# EAGLE schematic TRACKER SOM EVAL BOARD v1.0 (EAGLE 9.6.2)

## Sheet 1 of 5
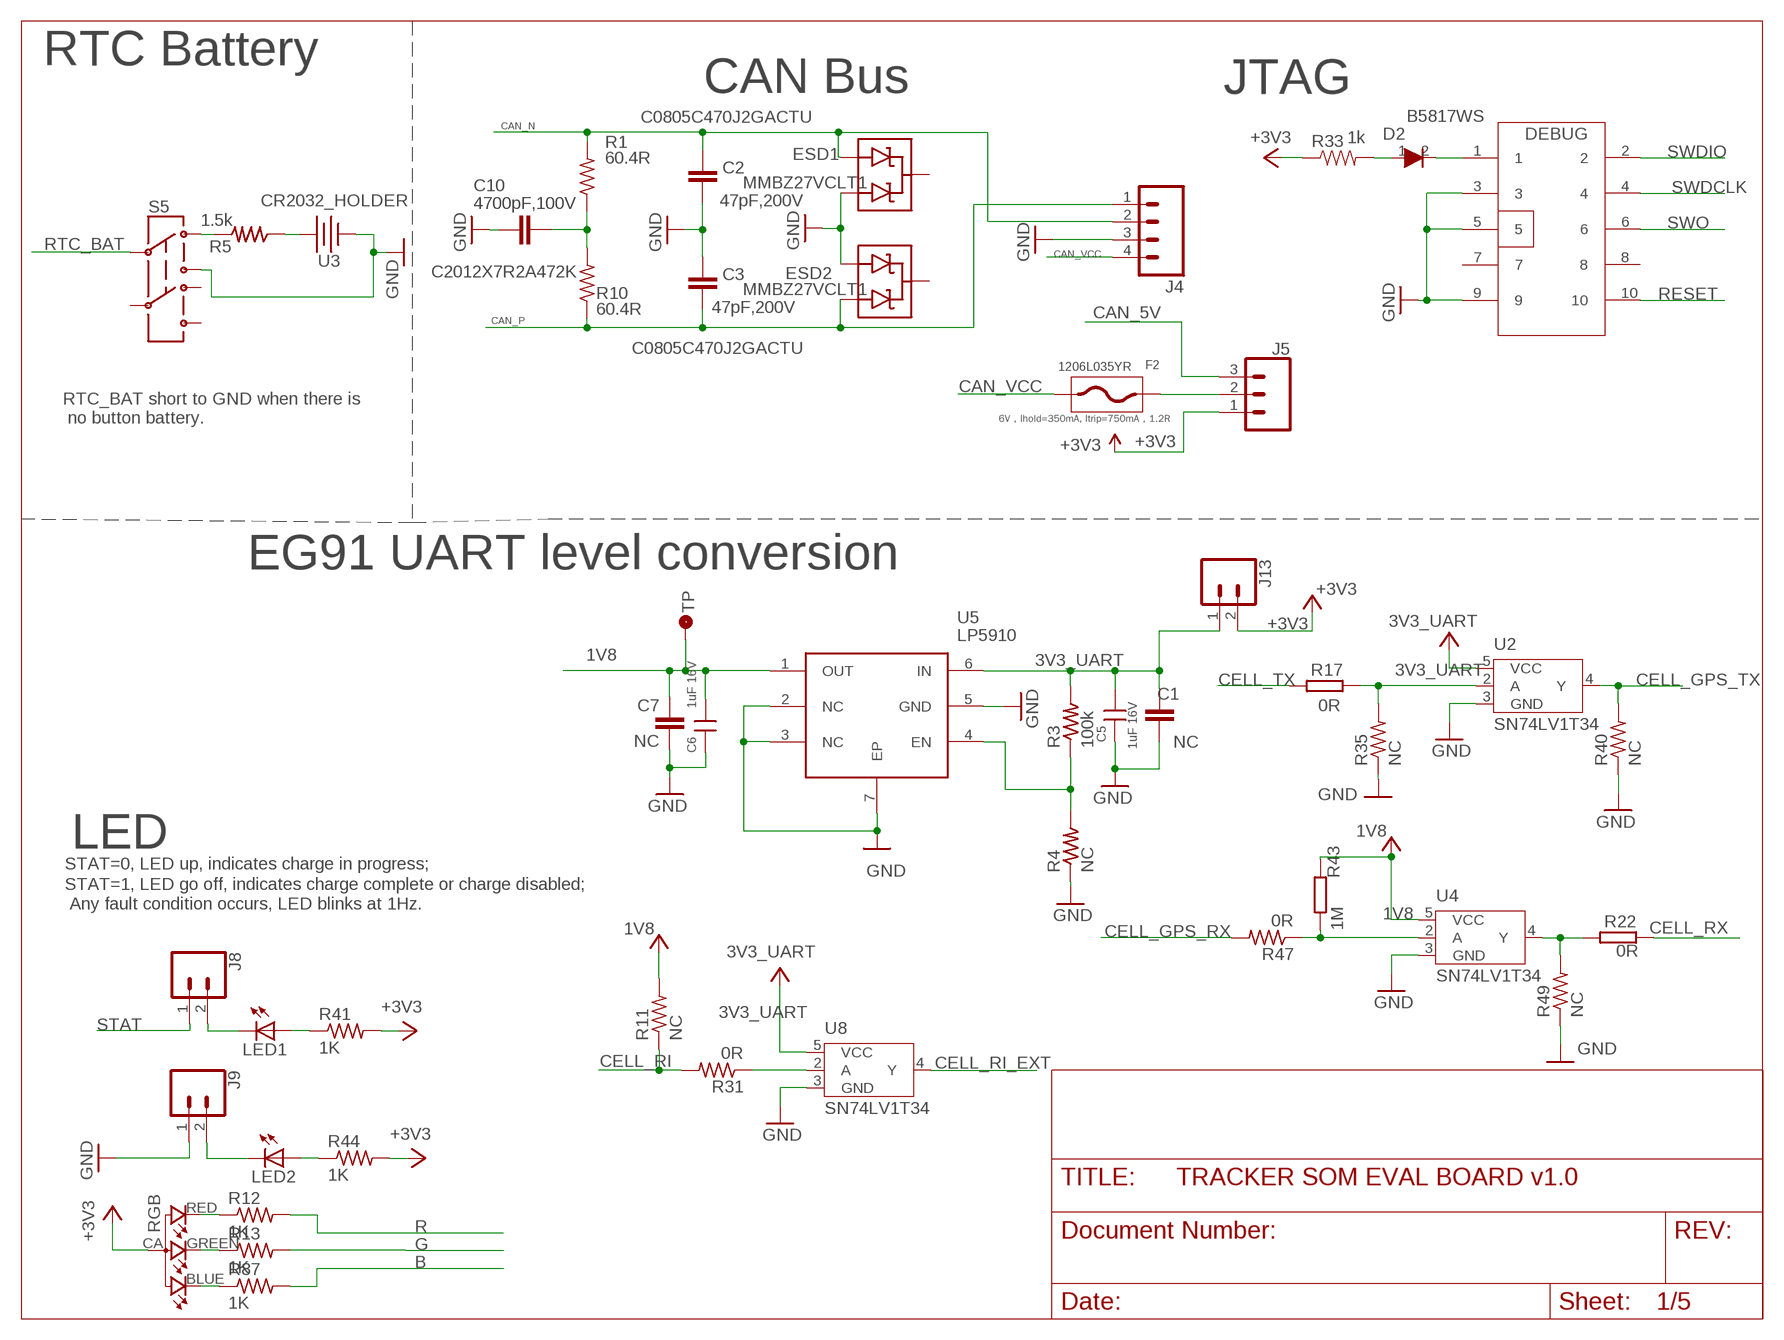
[diagram p0: schematic, sheet 1]

### Parts
C1  NC  C-EUC0805  [C0805]
C2  47pF,200V  C-EUC0805  [C0805]
C3  47pF,200V  C-EUC0805  [C0805]
C5  1uF 16V  CAPC0603  [C0603]
C6  1uF 16V  CAPC0603  [C0603]
C7  NC  C-EUC0805  [C0805]
C10  4700pF,100V  C-EUC0805  [C0805]
D2  B5817WS  DIODESOD323  [SOD-323]
DEBUG  CON 2X5P  CON5X2  [CON5X2_1.27]
ESD1  MMBZ27VCLT1  [SOT23-3]
ESD2  MMBZ27VCLT1  [SOT23-3]
F2  1206L035YR  FUSEF1206  [R1206]
J4  M04SCREW  [SCREWTERMINAL-3.5MM-4]
J5  CONN_03_2.54MM  [1X03]
J8  CONN_02  [1X02]
J9  CONN_02  [1X02]
J13  CONN_02  [1X02]
LED1  LED0603  [LED-0603]
LED2  LED0603  [LED-0603]
R1  60.4R  R-US_R1206  [R1206]
R3  100k  RES0402S  [R-0402S]
R4  NC  RES0402S  [R-0402S]
R5  1.5k  RES0402S  [R-0402S]
R10  60.4R  R-US_R1206  [R1206]
R11  NC  R-US_  [R0402_B]
R12  1K  R-US_R0603  [R0603]
R13  1K  R-US_R0603  [R0603]
R17  0R  RESR0603  [R0603]
R22  0R  RESR0603  [R0603]
R31  0R  R-US_  [R0402_B]
R33  1k  RESISTOR0603  [0603]
R35  NC  R-US_  [R0402_B]
R40  NC  R-US_  [R0402_B]
R41  1K  R-US_R0603  [R0603]
R43  1M  REDBEAR_RESR0603  [REDBEAR_R0603]
R44  1K  R-US_R0603  [R0603]
R47  0R  R-US_  [R0402_B]
R49  NC  R-US_  [R0402_B]
R87  1K  R-US_R0603  [R0603]
RGB  RGB-LED-CLMVB-FKARGB  [PLCC4-2MM-RGB]
S5  SWITCH-DPDT  [SWITCH-2.5X3.2-6]
U2  SN74LV1T34  [SC70-5]
U3  CR2032_HOLDER  [CR2032_HOLDER]
U4  SN74LV1T34  [SC70-5]
U5  LP5910  [QFN6P]
U8  SN74LV1T34  [SC70-5]
U$4  TP5  [TP30_TOP]

### Nets
1V8: C6.1 C7.1 R11.2 R43.1 U4.5(VCC) U5.1(OUT) U$4.P$1(TP)
3V3_UART: C1.1 C5.1 J13.1 R3.2 U2.5(VCC) U5.6(IN) U8.5(VCC)
+3V3 [+3V3]: J5.1 J13.2 R33.1 R41.2 R44.2 RGB.CA ; also sheet 2,4,5
B: R87.2 ; also sheet 2,5
CAN_5V: J5.3 ; also sheet 2
CAN_N [CAN]: C2.1 ESD1.2(A2) J4.2 R1.2 ; also sheet 2
CAN_P [CAN]: C3.2 ESD2.1(A1) J4.1 R10.1 ; also sheet 2
CAN_VCC: F2.1 J4.4
CELL_GPS_RX: R47.2 ; also sheet 5
CELL_GPS_TX: R40.2 U2.4(Y) ; also sheet 5
CELL_RI: R11.1 R31.2 ; also sheet 2
CELL_RI_EXT: U8.4(Y) ; also sheet 5
CELL_RX: R22.1 ; also sheet 2
CELL_TX: R17.2 ; also sheet 2
G: R13.2 ; also sheet 2,5
GND: C1.2 C2.2 C3.1 C5.2 C6.2 C7.2 C10.1 DEBUG.3 DEBUG.5 DEBUG.9 ESD1.1(A1) ESD2.2(A2) J4.3 J9.1 R4.1 R35.1 R40.1 R49.1 S5.3 U2.3(GND) U3.- U4.3(GND) U5.2(NC) U5.3(NC) U5.5(GND) U5.7(EP) U8.3(GND) ; also sheet 2,3,4,5
N$1: LED1.A R41.1
N$2: J8.2 LED1.C
N$4: LED2.A R44.1
N$7: J9.2 LED2.C
N$9: C10.2 R1.1 R10.2
N$10: R17.1 R35.2 U2.2(A)
N$14: R31.1 U8.2(A)
N$15: R3.1 R4.2 U5.4(EN)
N$16: R5.2 S5.1
N$20: R12.1 RGB.RED
N$22: R43.2 R47.1 U4.2(A)
N$24: F2.2 J5.2
N$25: R22.2 R49.2 U4.4(Y)
N$33: R87.1 RGB.BLUE
N$34: R13.1 RGB.GREEN
N$35: R5.1 U3.+
N$86: D2.1 R33.2
N$87 [3V3]: D2.2 DEBUG.1
R: R12.2 ; also sheet 2,5
RESET: DEBUG.10 ; also sheet 2,5
RTC_BAT: S5.2 ; also sheet 2,5
STAT: J8.1 ; also sheet 2,5
SWDCLK: DEBUG.4 ; also sheet 2
SWDIO: DEBUG.2 ; also sheet 2
SWO: DEBUG.6 ; also sheet 2
Unconnected: DEBUG.7 DEBUG.8 ESD1.3(C) ESD2.3(C) S5.4 S5.5 S5.6

### Notes on the sheet
- RTC Battery
- CAN Bus | JTAG
- 6V，Ihold=350mA, Itrip=750mA，1.2R
- RTC_BAT short to GND when there is
   no button battery.
- EG91 UART level conversion
- LED
- STAT=0, LED up, indicates charge in progress;
- STAT=1, LED go off, indicates charge complete or charge disabled;
- Any fault condition occurs, LED blinks at 1Hz.

## Sheet 2 of 5
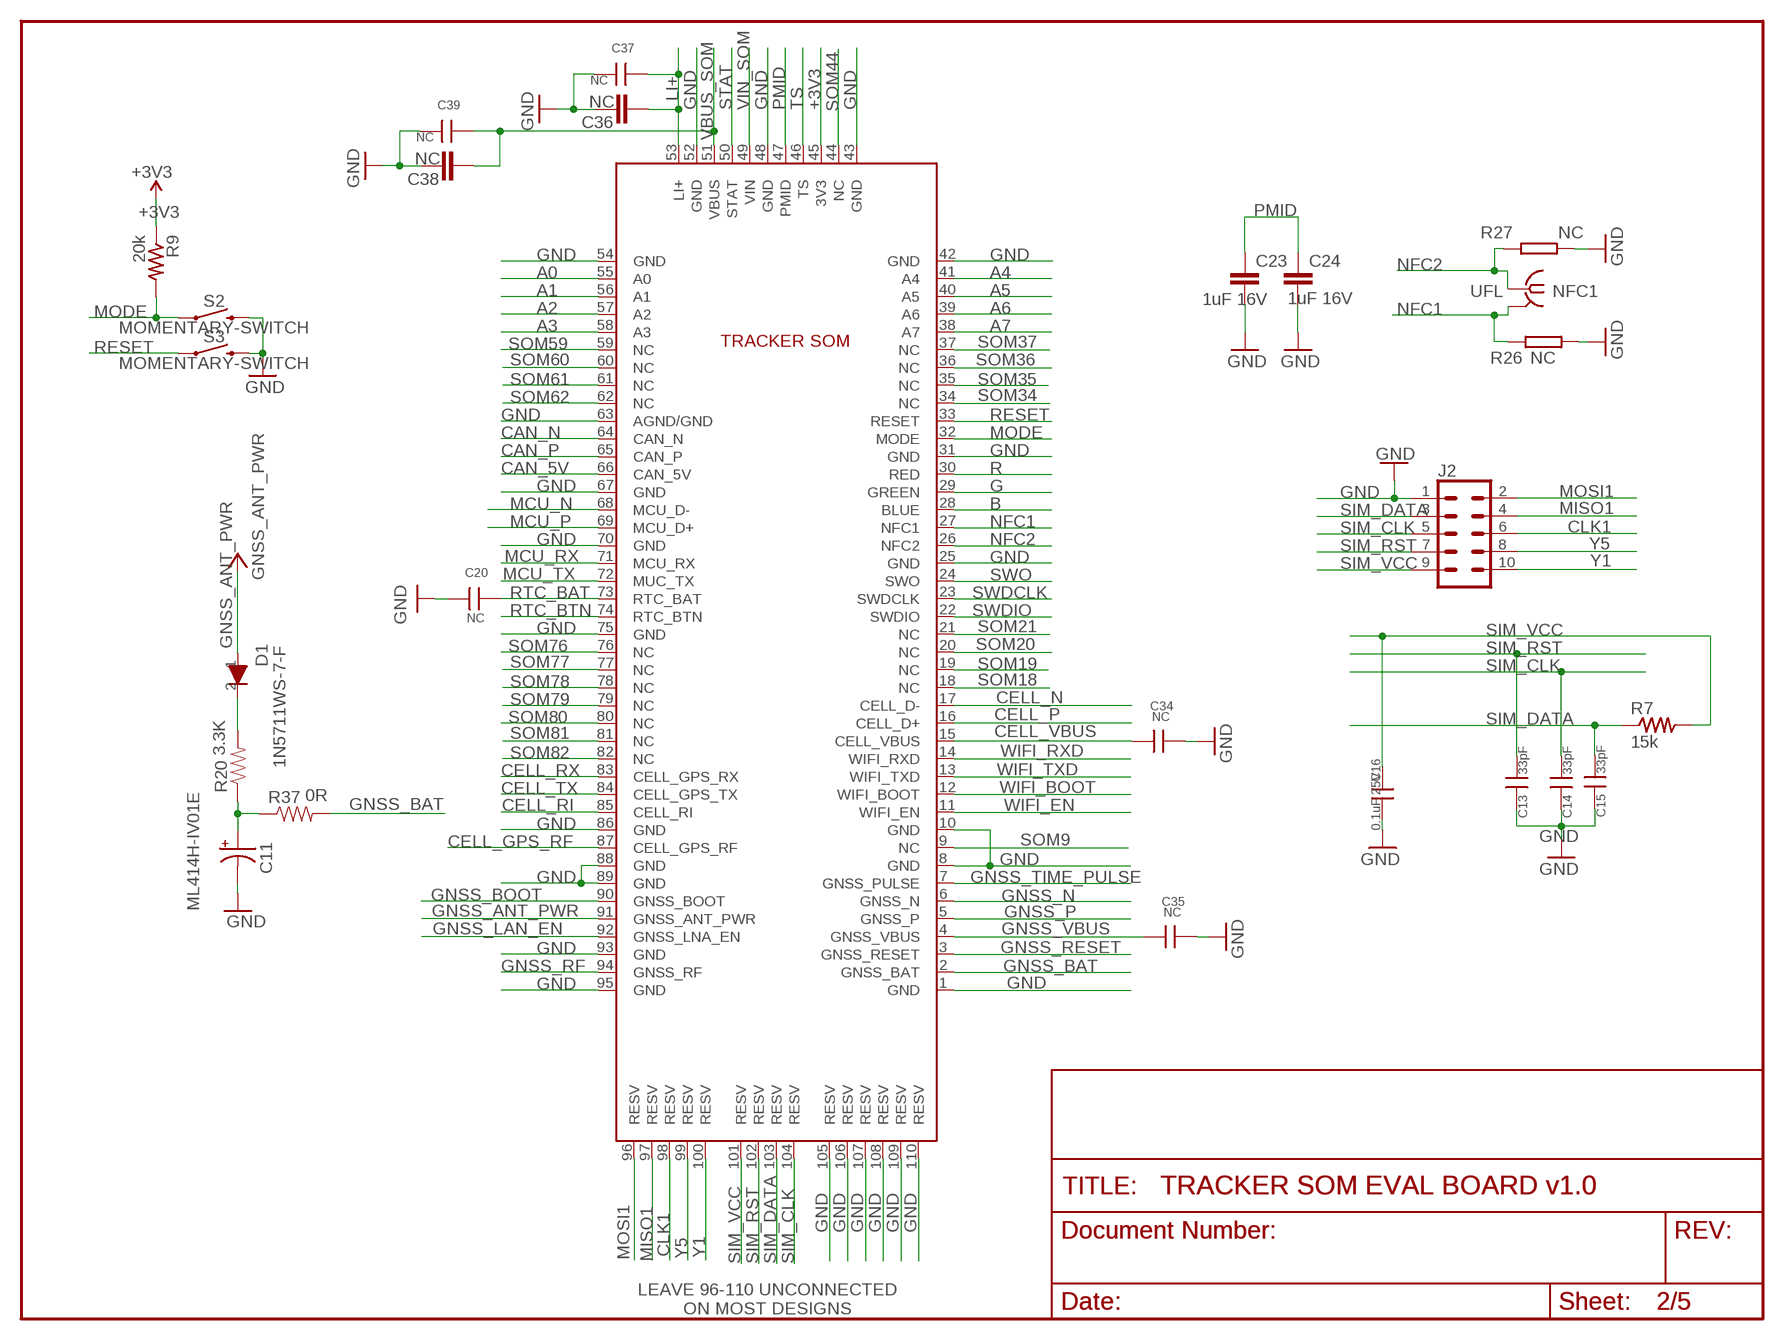
[diagram p1: schematic, sheet 2]

### Parts
C11  ML414H-IV01E  ML414HIV01E  [ML414H]
C13  33pF  CAP0402  [C-0402]
C14  33pF  CAP0402  [C-0402]
C15  33pF  CAP0402  [C-0402]
C16  0.1uF 25V  CAP0402  [C-0402]
C20  NC  CAP0402  [C-0402]
C23  1uF 16V  C-EUC0805  [C0805]
C24  1uF 16V  C-EUC0805  [C0805]
C34  NC  CAP0402  [C-0402]
C35  NC  CAP0402  [C-0402]
C36  NC  C-EUC1206  [C1206]
C37  NC  CAP0402  [C-0402]
C38  NC  C-EUC1206  [C1206]
C39  NC  CAP0402  [C-0402]
D1  1N5711WS-7-F  DIODESOD323  [SOD-323]
J2  CONN_05X2PTH  [2X5]
NFC1  UFL  IPEX-20279-001E  [IPEX-20279-001E]
R7  15k  RES0402S  [R-0402S]
R9  20k  RES0402S  [R-0402S]
R20  3.3K  RESISTOR0603  [0603]
R26  NC  RES0402S  [R-0402S]
R27  NC  RES0402S  [R-0402S]
R37  0R  RESISTOR0603  [0603]
S2  MOMENTARY-SWITCH  MOMENTARY-SWITCH-SPST-PTH-6.0MM  [TACTILE_SWITCH_PTH_6.0MM]
S3  MOMENTARY-SWITCH  MOMENTARY-SWITCH-SPST-PTH-6.0MM  [TACTILE_SWITCH_PTH_6.0MM]
U1  TRACKER-SOM-3A  [TRACKER-SOM-3A]

### Nets
+3V3 [+3V3]: R9.1 U1.45(3V3) ; also sheet 1,4,5
A0: U1.55(A0) ; also sheet 4,5
A1: U1.56(A1) ; also sheet 4,5
A2: U1.57(A2) ; also sheet 4,5
A3: U1.58(A3) ; also sheet 4,5
A4: U1.41(A4) ; also sheet 5
A5: U1.40(A5) ; also sheet 5
A6: U1.39(A6) ; also sheet 5
A7: U1.38(A7) ; also sheet 5
B: U1.28(BLUE) ; also sheet 1,5
CAN_5V: U1.66(CAN_5V) ; also sheet 1
CAN_N [CAN]: U1.64(CAN_N) ; also sheet 1
CAN_P [CAN]: U1.65(CAN_P) ; also sheet 1
CELL_GPS_RF: U1.87(CELL_GPS_RF)
CELL_N [USB_top]: U1.17(CELL_D-) ; also sheet 3
CELL_P [USB_top]: U1.16(CELL_D+) ; also sheet 3
CELL_RI: U1.85(CELL_RI) ; also sheet 1
CELL_RX: U1.83(CELL_GPS_RX) ; also sheet 1
CELL_TX: U1.84(CELL_GPS_TX) ; also sheet 1
CELL_VBUS: C34.2 U1.15(CELL_VBUS) ; also sheet 3
CLK1: J2.6 U1.98(RESV)
G: U1.29(GREEN) ; also sheet 1,5
GND: C11.- C13.1 C14.1 C15.1 C16.2 C20.1 C23.2 C24.2 C34.1 C35.1 C36.1 C37.1 C38.1 C39.1 J2.1 R26.2 R27.1 S2.3 S3.3 U1.1(GND) U1.8(GND) U1.10(GND) U1.25(GND) U1.31(GND) U1.42(GND) U1.43(GND) U1.48(GND) U1.52(GND) U1.54(GND) U1.63(AGND/GND) U1.67(GND) U1.70(GND) U1.75(GND) U1.86(GND) U1.88(GND) U1.89(GND) U1.93(GND) U1.95(GND) U1.105(RESV) U1.106(RESV) U1.107(RESV) U1.108(RESV) U1.109(RESV) U1.110(RESV) ; also sheet 1,3,4,5
GNSS_ANT_PWR: D1.1 U1.91(GNSS_ANT_PWR)
GNSS_BAT: R37.2 U1.2(GNSS_BAT)
GNSS_BOOT: U1.90(GNSS_BOOT)
GNSS_LAN_EN: U1.92(GNSS_LNA_EN)
GNSS_N [USB_top]: U1.6(GNSS_N) ; also sheet 3
GNSS_P [USB_top]: U1.5(GNSS_P) ; also sheet 3
GNSS_RESET: U1.3(GNSS_RESET)
GNSS_RF: U1.94(GNSS_RF)
GNSS_TIME_PULSE: U1.7(GNSS_PULSE) ; also sheet 5
GNSS_VBUS: C35.2 U1.4(GNSS_VBUS) ; also sheet 3
LI+ [+3V3]: C36.2 C37.2 U1.53(LI+) ; also sheet 4,5
MCU_N [USB_top]: U1.68(MCU_D-) ; also sheet 3
MCU_P [USB_top]: U1.69(MCU_D+) ; also sheet 3
MCU_RX: U1.71(MCU_RX) ; also sheet 5
MCU_TX: U1.72(MUC_TX) ; also sheet 5
MISO1: J2.4 U1.97(RESV)
MODE: R9.2 S2.1 U1.32(MODE) ; also sheet 5
MOSI1: J2.2 U1.96(RESV)
N$3: D1.2 R20.2
N$36: C11.+ R20.1 R37.1
NFC1: NFC1.2@1(GND) NFC1.2@2(GND) R26.1 U1.27(NFC1) ; also sheet 5
NFC2: NFC1.1 R27.2 U1.26(NFC2) ; also sheet 5
PMID: C23.1 C24.1 U1.47(PMID) ; also sheet 5
R: U1.30(RED) ; also sheet 1,5
RESET: S3.1 U1.33(RESET) ; also sheet 1,5
RTC_BAT: C20.2 U1.73(RTC_BAT) ; also sheet 1,5
RTC_BTN: U1.74(RTC_BTN) ; also sheet 5
SIM_CLK: C14.2 J2.5 U1.104(RESV)
SIM_DATA: C15.2 J2.3 R7.1 U1.103(RESV)
SIM_RST: C13.2 J2.7 U1.102(RESV)
SIM_VCC: C16.1 J2.9 R7.2 U1.101(RESV)
SOM9: U1.9(NC) ; also sheet 5
SOM18: U1.18(NC) ; also sheet 5
SOM19: U1.19(NC) ; also sheet 5
SOM20: U1.20(NC) ; also sheet 5
SOM21: U1.21(NC) ; also sheet 5
SOM34: U1.34(NC) ; also sheet 5
SOM35: U1.35(NC) ; also sheet 5
SOM36: U1.36(NC) ; also sheet 5
SOM37: U1.37(NC) ; also sheet 5
SOM44: U1.44(NC) ; also sheet 5
SOM59: U1.59(NC) ; also sheet 5
SOM60: U1.60(NC) ; also sheet 5
SOM61: U1.61(NC) ; also sheet 5
SOM62: U1.62(NC) ; also sheet 5
SOM76: U1.76(NC) ; also sheet 5
SOM77: U1.77(NC) ; also sheet 5
SOM78: U1.78(NC) ; also sheet 5
SOM79: U1.79(NC) ; also sheet 5
SOM80: U1.80(NC) ; also sheet 5
SOM81: U1.81(NC) ; also sheet 5
SOM82: U1.82(NC) ; also sheet 5
STAT: U1.50(STAT) ; also sheet 1,5
SWDCLK: U1.23(SWDCLK) ; also sheet 1
SWDIO: U1.22(SWDIO) ; also sheet 1
SWO: U1.24(SWO) ; also sheet 1
TS: U1.46(TS) ; also sheet 4,5
VBUS_SOM: C38.2 C39.2 U1.51(VBUS) ; also sheet 4,5
VIN_SOM: U1.49(VIN) ; also sheet 4,5
WIFI_BOOT: U1.12(WIFI_BOOT) ; also sheet 5
WIFI_EN: U1.11(WIFI_EN) ; also sheet 5
WIFI_RXD: U1.14(WIFI_RXD) ; also sheet 5
WIFI_TXD: U1.13(WIFI_TXD) ; also sheet 5
Y1: J2.10 U1.100(RESV)
Y5: J2.8 U1.99(RESV)

### Notes on the sheet
- LEAVE 96-110 UNCONNECTED
  ON MOST DESIGNS

## Sheet 3 of 5
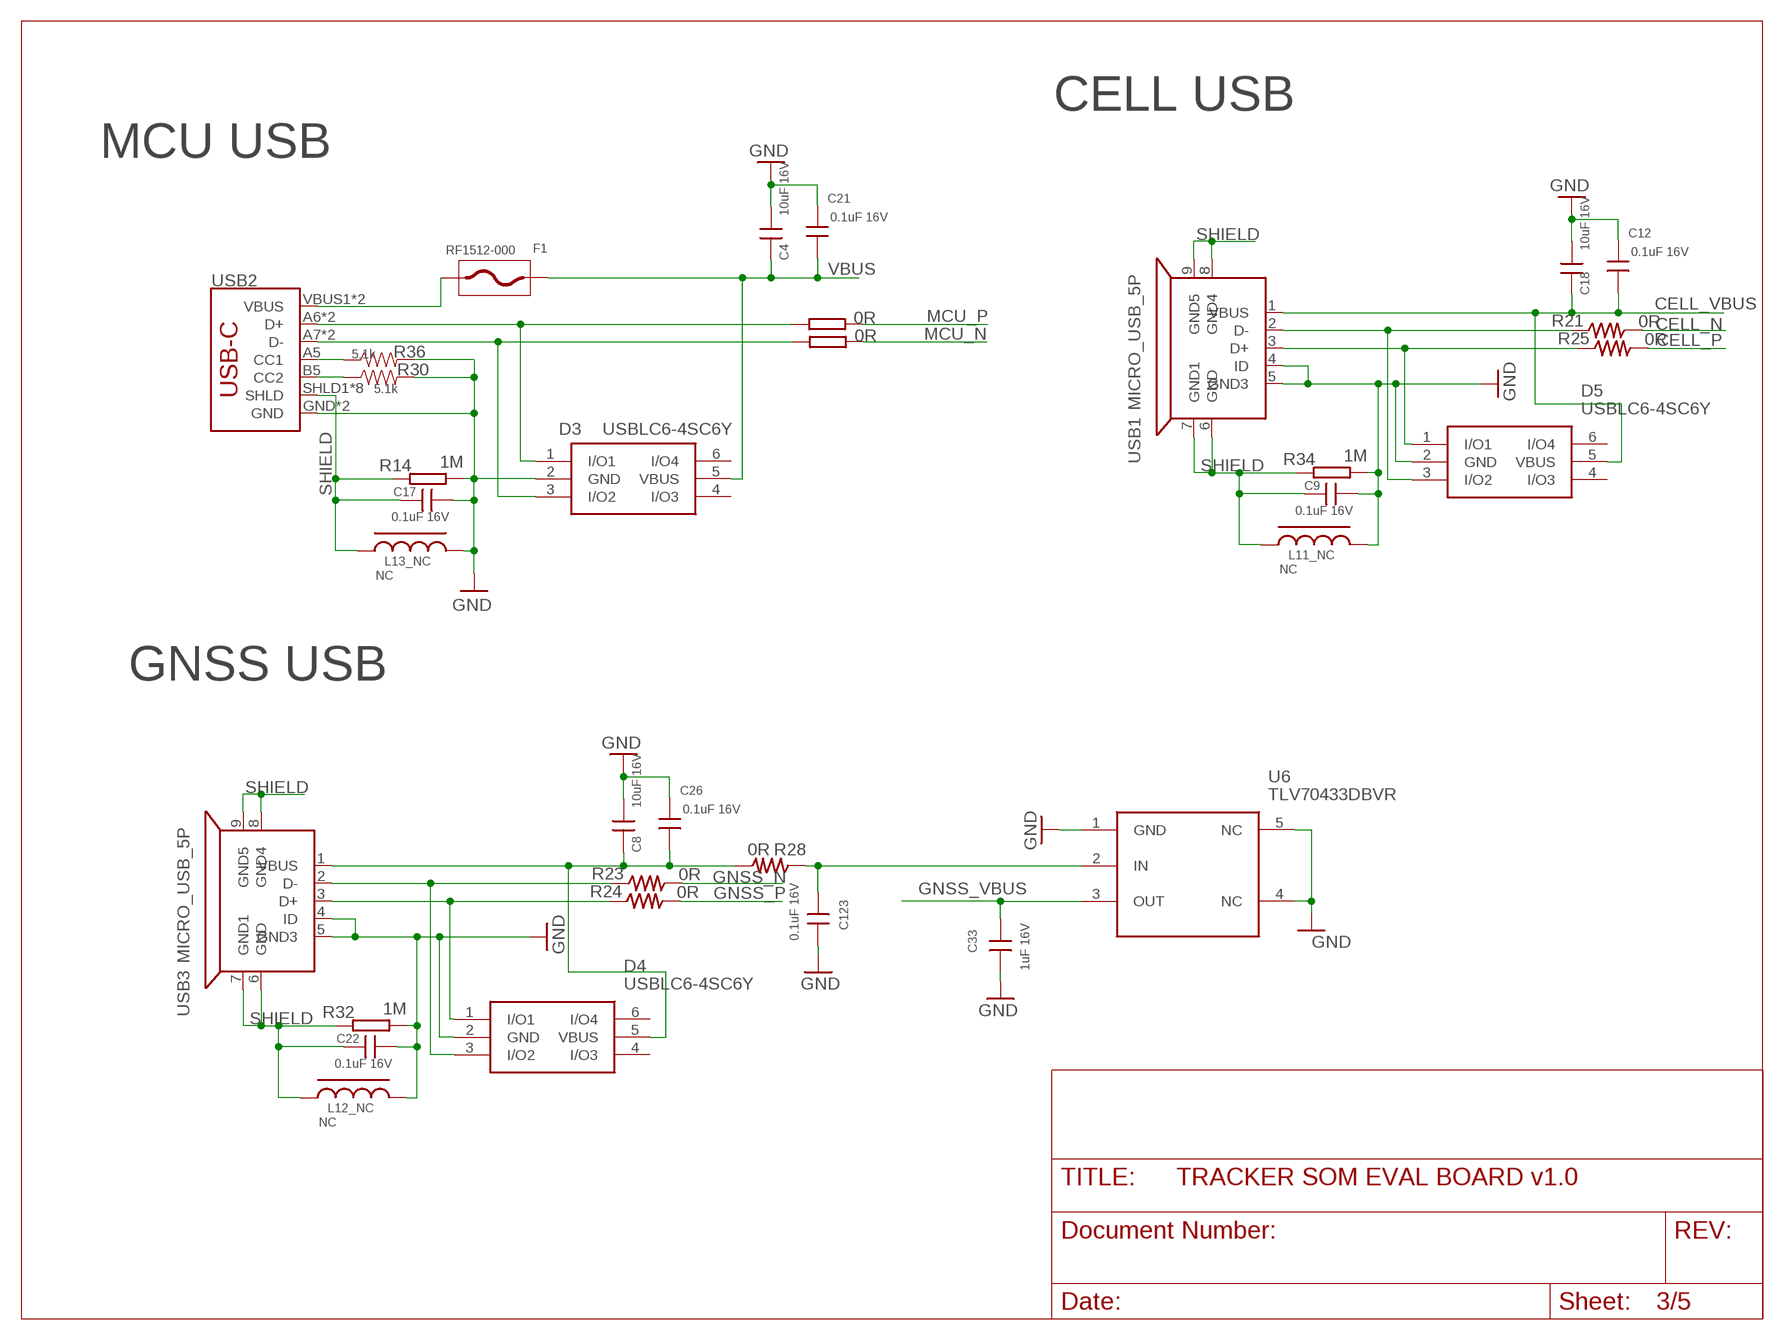
[diagram p2: schematic, sheet 3]

### Parts
C4  10uF 16V  REDBEAR_CAPC0603  [REDBEAR_C0603]
C8  10uF 16V  REDBEAR_CAPC0603  [REDBEAR_C0603]
C9  0.1uF 16V  PARTICLE-SZ_CAP0402  [PARTICLE-SZ_C-0402]
C12  0.1uF 16V  CAP0402  [C-0402]
C17  0.1uF 16V  PARTICLE-SZ_CAP0402  [PARTICLE-SZ_C-0402]
C18  10uF 16V  REDBEAR_CAPC0603  [REDBEAR_C0603]
C21  0.1uF 16V  CAP0402  [C-0402]
C22  0.1uF 16V  PARTICLE-SZ_CAP0402  [PARTICLE-SZ_C-0402]
C26  0.1uF 16V  CAP0402  [C-0402]
C33  1uF 16V  CAPC0603  [C0603]
C123  0.1uF 16V  CAP0402  [C-0402]
D3  USBLC6-4SC6Y  [SOT95P280X145-6N]
D4  USBLC6-4SC6Y  [SOT95P280X145-6N]
D5  USBLC6-4SC6Y  [SOT95P280X145-6N]
F1  RF1512-000  FUSEF1206  [R1206]
L11_NC  NC  L  [R-0603A]
L12_NC  NC  L  [R-0603A]
L13_NC  NC  L  [R-0603A]
R14  1M  REDBEAR_RESR0603  [REDBEAR_R0603]
R15  0R  RES0402S  [R-0402S]
R16  0R  RES0402S  [R-0402S]
R21  0R  RES0402S  [R-0402S]
R23  0R  RES0402S  [R-0402S]
R24  0R  RES0402S  [R-0402S]
R25  0R  RES0402S  [R-0402S]
R28  0R  RES0402S  [R-0402S]
R30  5.1k  RESISTOR0402  [C0402]
R32  1M  REDBEAR_RESR0603  [REDBEAR_R0603]
R34  1M  REDBEAR_RESR0603  [REDBEAR_R0603]
R36  5.1k  RESISTOR0402  [C0402]
U6  TLV70433DBVR  [TLV70433DBVR]
USB1  MICRO_USB_5P  MICRO_USBMICRO_USB  [MICRO_USB]
USB2  USB_C16PIN  [USB-C-16P]
USB3  MICRO_USB_5P  MICRO_USBMICRO_USB  [MICRO_USB]

### Nets
CELL_N [USB_top]: R21.2 ; also sheet 2
CELL_P [USB_top]: R25.2 ; also sheet 2
CELL_VBUS: C12.1 C18.2 D5.5(VBUS) USB1.1(VBUS) ; also sheet 2
GND: C4.1 C8.1 C9.2 C12.2 C17.2 C18.1 C21.2 C22.2 C26.2 C33.2 C123.2 D3.2(GND) D4.2(GND) D5.2(GND) L11_NC.2 L12_NC.2 L13_NC.2 R14.2 R30.2 R32.2 R34.2 R36.2 U6.1(GND) U6.4(NC) U6.5(NC) USB1.4(ID) USB1.5(GND3) USB2.GND USB2.GND2(GND) USB3.4(ID) USB3.5(GND3) ; also sheet 1,2,4,5
GNSS_N [USB_top]: R23.2 ; also sheet 2
GNSS_P [USB_top]: R24.2 ; also sheet 2
GNSS_VBUS: C33.1 U6.3(OUT) ; also sheet 2
MCU_N [USB_top]: R15.2 ; also sheet 2
MCU_P [USB_top]: R16.2 ; also sheet 2
N$6: D3.3(I/O2) R15.1 USB2.A7(D-) USB2.B7(D-)
N$11: D3.1(I/O1) R16.1 USB2.A6(D+) USB2.B6(D+)
N$12: D4.3(I/O2) R23.1 USB3.2(D-)
N$13: D5.3(I/O2) R21.1 USB1.2(D-)
N$17: D5.1(I/O1) R25.1 USB1.3(D+)
N$18: F1.1 USB2.VBUS1(VBUS) USB2.VBUS2(VBUS)
N$23: D4.1(I/O1) R24.1 USB3.3(D+)
N$30: C123.1 R28.1 U6.2(IN)
N$38: R30.1 USB2.B5(CC2)
N$41: R36.1 USB2.A5(CC1)
SHIELD: C9.1 C17.1 C22.1 L11_NC.1 L12_NC.1 L13_NC.1 R14.1 R32.1 R34.1 USB1.6(GND) USB1.7(GND1) USB1.8(GND4) USB1.9(GND5) USB2.SHLD1(SHLD) USB2.SHLD2(SHLD) USB2.SHLD3(SHLD) USB2.SHLD4(SHLD) USB2.SHLD5(SHLD) USB2.SHLD6(SHLD) USB2.SHLD7(SHLD) USB2.SHLD8(SHLD) USB3.6(GND) USB3.7(GND1) USB3.8(GND4) USB3.9(GND5)
U_VBUS: C8.2 C26.1 D4.5(VBUS) R28.2 USB3.1(VBUS)
VBUS: C4.2 C21.1 D3.5(VBUS) F1.2 ; also sheet 4
Unconnected: D3.4(I/O3) D3.6(I/O4) D4.4(I/O3) D4.6(I/O4) D5.4(I/O3) D5.6(I/O4)

### Notes on the sheet
- CELL USB
- MCU USB
- GNSS USB

## Sheet 4 of 5
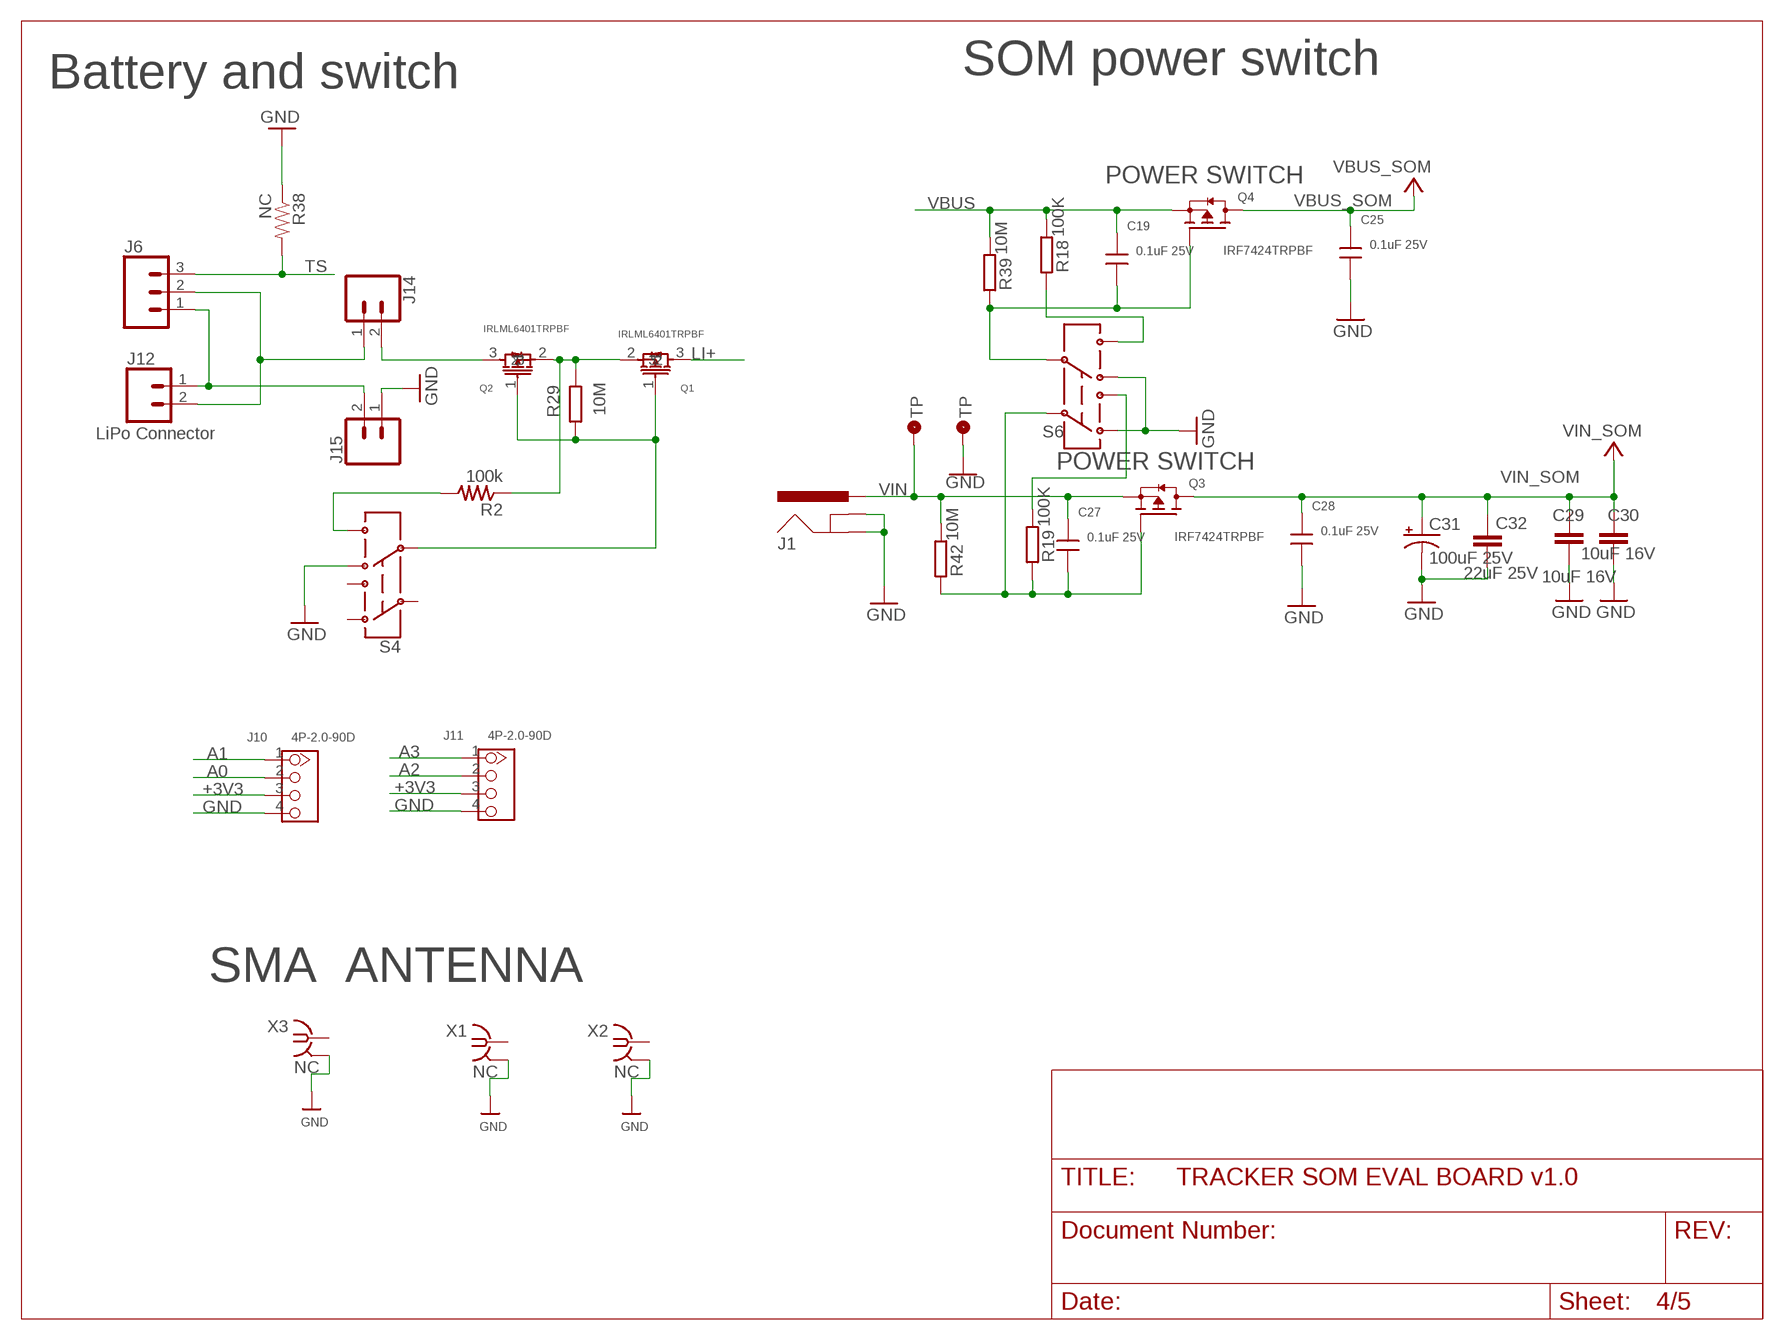
[diagram p3: schematic, sheet 4]

### Parts
C19  0.1uF 25V  CAP0402  [C-0402]
C25  0.1uF 25V  CAP0402  [C-0402]
C27  0.1uF 25V  CAP0402  [C-0402]
C28  0.1uF 25V  CAP0402  [C-0402]
C29  10uF 16V  C-EUC0805  [C0805]
C30  10uF 16V  C-EUC0805  [C0805]
C31  100uF 25V  100UF-POLAR-25V-20%(ELEC)  [PANASONIC_D]
C32  22uF 25V  C-EUC1206  [C1206]
J1  POWER_JACKSLT  [POWER_JACK_SLOT]
J6  CONN_03_2.54MM  [1X03]
J10  4P-2.0-90D  GROVE-CONNECTOR-DIP-90D(4P-2.0)  [HW4-2.0-90D]
J11  4P-2.0-90D  GROVE-CONNECTOR-DIP-90D(4P-2.0)  [HW4-2.0-90D]
J12  CONN_02-JST-2MM-SMT  [JST-2-SMD]
J14  CONN_02  [1X02]
J15  CONN_02  [1X02]
Q1  IRLML6401TRPBF  PMOS  [SOT-23]
Q2  IRLML6401TRPBF  PMOS  [SOT-23]
Q3  IRF7424TRPBF  PMOS_IRF7424  [PMOS_IRF7424]
Q4  IRF7424TRPBF  PMOS_IRF7424  [PMOS_IRF7424]
R2  100k  RES0402S  [R-0402S]
R18  100K  RESR0603  [R0603]
R19  100K  RESR0603  [R0603]
R29  10M  RESR0603  [R0603]
R38  NC  100OHM-1/10W-1%(0603)  [0603-RES]
R39  10M  RESR0603  [R0603]
R42  10M  RESR0603  [R0603]
S4  SWITCH-DPDT  [SWITCH-2.5X3.2-6]
S6  SWITCH-DPDT  [SWITCH-2.5X3.2-6]
U$9  TP2  [TP70_BOT]
U$10  TP2  [TP70_BOT]
X1  NC  BU-SMA-G  [BU-SMA-G]
X2  NC  BU-SMA-G  [BU-SMA-G]
X3  NC  BU-SMA-G  [BU-SMA-G]

### Nets
+3V3 [+3V3]: J10.3 J11.3 ; also sheet 1,2,5
A0: J10.2 ; also sheet 2,5
A1: J10.1 ; also sheet 2,5
A2: J11.2 ; also sheet 2,5
A3: J11.1 ; also sheet 2,5
GND: C25.1 C28.1 C29.2 C30.2 C31.- C32.2 J1.GND@1(GNDBREAK) J1.GND@2(GND) J10.4 J11.4 J15.1 R38.1 S4.4 S6.1 S6.4 U$10.P$1(TP) X1.2 X1.3 X1.4 X1.5 X2.2 X2.3 X2.4 X2.5 X3.2 X3.3 X3.4 X3.5 ; also sheet 1,2,3,5
LI+ [+3V3]: Q1.3 ; also sheet 2,5
N$19: J14.2 Q2.3
N$21: R2.2 S4.6
N$26: J6.1 J12.1 J15.2
N$27: R18.1 S6.6
N$28: R19.2 S6.3
N$29: J6.2 J12.2 J14.1
N$46: Q1.2 Q2.2 R2.1 R29.2
N$47: Q1.1 Q2.1 R29.1 S4.5
SYS_PWR_EN1: C19.1 Q4.4(G) R39.1 S6.5
SYS_PWR_EN2: C27.1 Q3.4(G) R19.1 R42.1 S6.2
TS: J6.3 R38.2 ; also sheet 2,5
VBUS: C19.2 Q4.1(S) Q4.2(S) Q4.3(S) R18.2 R39.2 ; also sheet 3
VBUS_SOM: C25.2 Q4.5(D) Q4.6(D) Q4.7(D) Q4.8(D) ; also sheet 2,5
VIN [vcc]: C27.2 J1.PWR Q3.1(S) Q3.2(S) Q3.3(S) R42.2 U$9.P$1(TP)
VIN_SOM: C28.2 C29.1 C30.1 C31.+ C32.1 Q3.5(D) Q3.6(D) Q3.7(D) Q3.8(D) ; also sheet 2,5
Unconnected: S4.1 S4.2 S4.3 X1.1 X2.1 X3.1

### Notes on the sheet
- Battery and switch | SOM power switch
- POWER SWITCH
- LiPo Connector
- POWER SWITCH
- SMA  ANTENNA

## Sheet 5 of 5
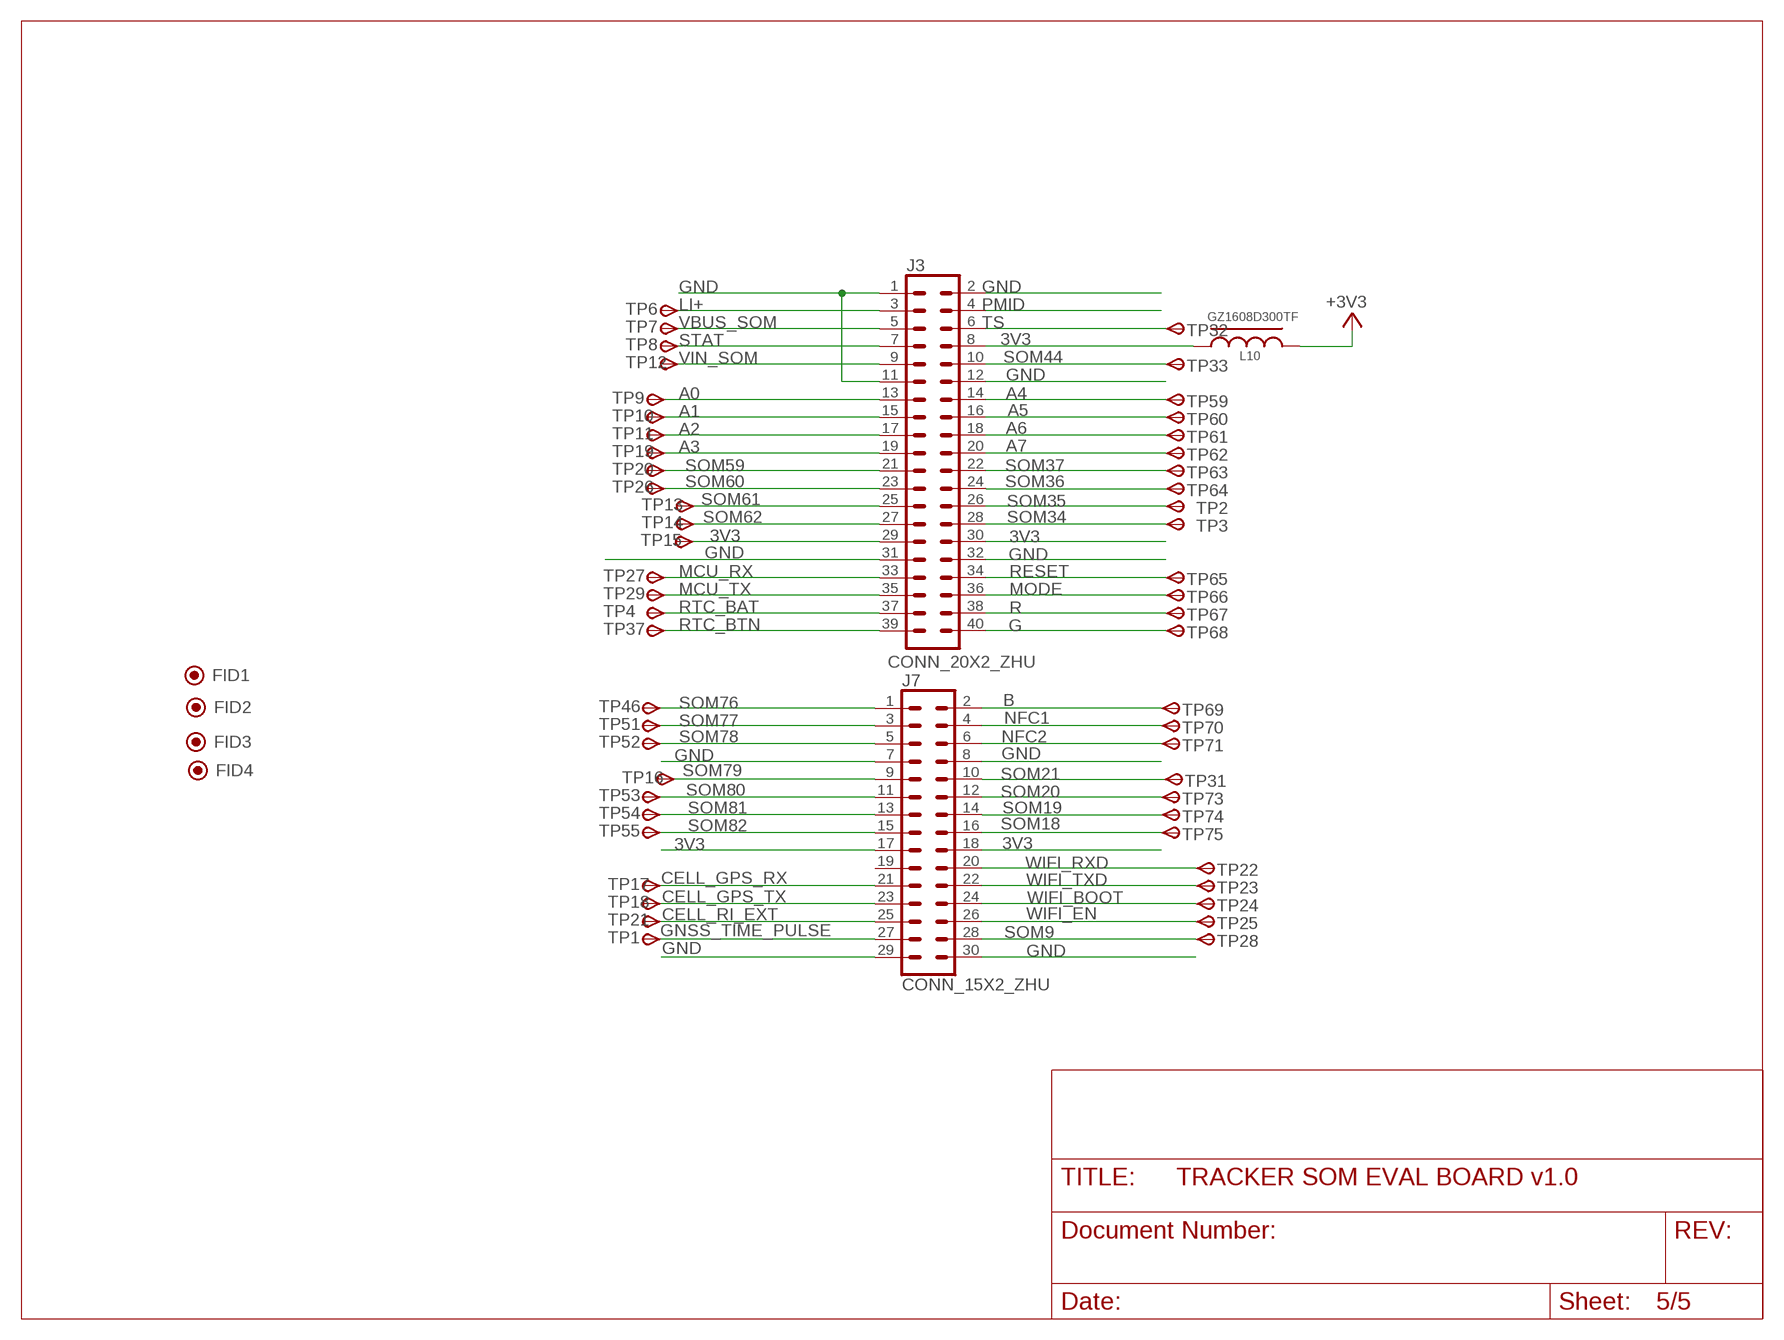
[diagram p4: schematic, sheet 5]

### Parts
FID1  FIDUCIAL_2  [FID_TOP_1MM]
FID2  FIDUCIAL_2  [FID_TOP_1MM]
FID3  FIDUCIAL_2  [FID_TOP_1MM]
FID4  FIDUCIAL_2  [FID_TOP_1MM]
J3  CONN_20X2_ZHU  [SMD_2*20]
J7  CONN_15X2_ZHU  [SMD_2*15]
L10  GZ1608D300TF  L  [R-0603A]
TP1  TPSB1,27  [B1,27]
TP2  TPSB1,27  [B1,27]
TP3  TPSB1,27  [B1,27]
TP4  TPSB1,27  [B1,27]
TP6  TPSB1,27  [B1,27]
TP7  TPSB1,27  [B1,27]
TP8  TPSB1,27  [B1,27]
TP9  TPSB1,27  [B1,27]
TP10  TPSB1,27  [B1,27]
TP11  TPSB1,27  [B1,27]
TP12  TPSB1,27  [B1,27]
TP13  TPSB1,27  [B1,27]
TP14  TPSB1,27  [B1,27]
TP15  TPSB1,27  [B1,27]
TP16  TPSB1,27  [B1,27]
TP17  TPSB1,27  [B1,27]
TP18  TPSB1,27  [B1,27]
TP19  TPSB1,27  [B1,27]
TP20  TPSB1,27  [B1,27]
TP21  TPSB1,27  [B1,27]
TP22  TPSB1,27  [B1,27]
TP23  TPSB1,27  [B1,27]
TP24  TPSB1,27  [B1,27]
TP25  TPSB1,27  [B1,27]
TP26  TPSB1,27  [B1,27]
TP27  TPSB1,27  [B1,27]
TP28  TPSB1,27  [B1,27]
TP29  TPSB1,27  [B1,27]
TP31  TPSB1,27  [B1,27]
TP32  TPSB1,27  [B1,27]
TP33  TPSB1,27  [B1,27]
TP37  TPSB1,27  [B1,27]
TP46  TPSB1,27  [B1,27]
TP51  TPSB1,27  [B1,27]
TP52  TPSB1,27  [B1,27]
TP53  TPSB1,27  [B1,27]
TP54  TPSB1,27  [B1,27]
TP55  TPSB1,27  [B1,27]
TP59  TPSB1,27  [B1,27]
TP60  TPSB1,27  [B1,27]
TP61  TPSB1,27  [B1,27]
TP62  TPSB1,27  [B1,27]
TP63  TPSB1,27  [B1,27]
TP64  TPSB1,27  [B1,27]
TP65  TPSB1,27  [B1,27]
TP66  TPSB1,27  [B1,27]
TP67  TPSB1,27  [B1,27]
TP68  TPSB1,27  [B1,27]
TP69  TPSB1,27  [B1,27]
TP70  TPSB1,27  [B1,27]
TP71  TPSB1,27  [B1,27]
TP73  TPSB1,27  [B1,27]
TP74  TPSB1,27  [B1,27]
TP75  TPSB1,27  [B1,27]

### Nets
3V3: J3.8 J3.29 J3.30 J7.17 J7.18 L10.1 TP15.TP(PP)
+3V3 [+3V3]: L10.2 ; also sheet 1,2,4
A0: J3.13 TP9.TP(PP) ; also sheet 2,4
A1: J3.15 TP10.TP(PP) ; also sheet 2,4
A2: J3.17 TP11.TP(PP) ; also sheet 2,4
A3: J3.19 TP19.TP(PP) ; also sheet 2,4
A4: J3.14 TP59.TP(PP) ; also sheet 2
A5: J3.16 TP60.TP(PP) ; also sheet 2
A6: J3.18 TP61.TP(PP) ; also sheet 2
A7: J3.20 TP62.TP(PP) ; also sheet 2
B: J7.2 TP69.TP(PP) ; also sheet 1,2
CELL_GPS_RX: J7.21 TP17.TP(PP) ; also sheet 1
CELL_GPS_TX: J7.23 TP18.TP(PP) ; also sheet 1
CELL_RI_EXT: J7.25 TP21.TP(PP) ; also sheet 1
G: J3.40 TP68.TP(PP) ; also sheet 1,2
GND: J3.1 J3.2 J3.11 J3.12 J3.31 J3.32 J7.7 J7.8 J7.29 J7.30 ; also sheet 1,2,3,4
GNSS_TIME_PULSE: J7.27 TP1.TP(PP) ; also sheet 2
LI+ [+3V3]: J3.3 TP6.TP(PP) ; also sheet 2,4
MCU_RX: J3.33 TP27.TP(PP) ; also sheet 2
MCU_TX: J3.35 TP29.TP(PP) ; also sheet 2
MODE: J3.36 TP66.TP(PP) ; also sheet 2
NFC1: J7.4 TP70.TP(PP) ; also sheet 2
NFC2: J7.6 TP71.TP(PP) ; also sheet 2
PMID: J3.4 ; also sheet 2
R: J3.38 TP67.TP(PP) ; also sheet 1,2
RESET: J3.34 TP65.TP(PP) ; also sheet 1,2
RTC_BAT: J3.37 TP4.TP(PP) ; also sheet 1,2
RTC_BTN: J3.39 TP37.TP(PP) ; also sheet 2
SOM9: J7.28 TP28.TP(PP) ; also sheet 2
SOM18: J7.16 TP75.TP(PP) ; also sheet 2
SOM19: J7.14 TP74.TP(PP) ; also sheet 2
SOM20: J7.12 TP73.TP(PP) ; also sheet 2
SOM21: J7.10 TP31.TP(PP) ; also sheet 2
SOM34: J3.28 TP3.TP(PP) ; also sheet 2
SOM35: J3.26 TP2.TP(PP) ; also sheet 2
SOM36: J3.24 TP64.TP(PP) ; also sheet 2
SOM37: J3.22 TP63.TP(PP) ; also sheet 2
SOM44: J3.10 TP33.TP(PP) ; also sheet 2
SOM59: J3.21 TP20.TP(PP) ; also sheet 2
SOM60: J3.23 TP26.TP(PP) ; also sheet 2
SOM61: J3.25 TP13.TP(PP) ; also sheet 2
SOM62: J3.27 TP14.TP(PP) ; also sheet 2
SOM76: J7.1 TP46.TP(PP) ; also sheet 2
SOM77: J7.3 TP51.TP(PP) ; also sheet 2
SOM78: J7.5 TP52.TP(PP) ; also sheet 2
SOM79: J7.9 TP16.TP(PP) ; also sheet 2
SOM80: J7.11 TP53.TP(PP) ; also sheet 2
SOM81: J7.13 TP54.TP(PP) ; also sheet 2
SOM82: J7.15 TP55.TP(PP) ; also sheet 2
STAT: J3.7 TP8.TP(PP) ; also sheet 1,2
TS: J3.6 TP32.TP(PP) ; also sheet 2,4
VBUS_SOM: J3.5 TP7.TP(PP) ; also sheet 2,4
VIN_SOM: J3.9 TP12.TP(PP) ; also sheet 2,4
WIFI_BOOT: J7.24 TP24.TP(PP) ; also sheet 2
WIFI_EN: J7.26 TP25.TP(PP) ; also sheet 2
WIFI_RXD: J7.20 TP22.TP(PP) ; also sheet 2
WIFI_TXD: J7.22 TP23.TP(PP) ; also sheet 2
Unconnected: J7.19

## Library data of the parts
C1 C7 C23 C24 C29 C30 C32 C36 C38 = rcl:C-EU: CAPACITOR, European symbol; SPICEPREFIX: C
C2 C3 = rcl:C-EU: CAPACITOR, European symbol; PART_NUMBER: C0805C470J2GACTU; SPICEPREFIX: C
C4 C8 C18 = Asset Tracker SoM v0.01:REDBEAR_CAP: CAP
C5 C6 C33 = Particle Testing fleet board_Gen3:CAP: CAP
C9 C17 C22 = Asset Tracker SoM v0.01:PARTICLE-SZ_CAP: CAP
C10 = rcl:C-EU: CAPACITOR, European symbol; PART_NUMBER: C2012X7R2A472K; SPICEPREFIX: C
C11 = particle-internal:ML414HIV01E
C12-C16 C19-C21 C25-C28 C34 C35 C37 C39 = RedBear:CAP: CAP
C31 = SparkFun-Capacitors:100UF-POLAR: 100µF polarized capacitors A capacitor is a passive two-terminal electrical component used to store electrical energy temporarily in an electric field.; PROD_ID: CAP-12547; VALUE: 100uF
C123 = particle SZ:CAP: CAP
D1 D2 = particle SZ:DIODE: DIODE
D3-D5 = 1SamacSys_Parts:USBLC6-4SC6Y: STMICROELECTRONICS - USBLC6-4SC6Y - ESD Protection Device, 17 V, SOT-23, 6 Pins Source: Datasheet <https://componentsearchengine.com/Datasheets/1/USBLC6-4SC6Y.pdf>; DESCRIPTION: STMICROELECTRONICS - USBLC6-4SC6Y - ESD Protection Device, 17 V, SOT-23, 6 Pins; HEIGHT: 1.45mm; MANUFACTURER_NAME: STMicroelectronics; MANUFACTURER_PART_NUMBER: USBLC6-4SC6Y; MOUSER_PART_NUMBER: 511-USBLC6-4SC6Y; MOUSER_PRICE-STOCK: https://www.mouser.com/Search/Refine.aspx?Keyword=511-USBLC6-4SC6Y
DEBUG = RedBear:CON5X2
ESD1 ESD2 = SparkFun:MMBZ27VCLT1
F1 F2 = RedBear:FUSE
FID1-FID4 = Particle:FIDUCIAL
J1 = Particle:POWER_JACK: Power Jack This is the standard 5.5mm barrel jack for power. The PTH is the most common, proven, reliable, footprint. The Slot footprint only works if the mill layer is transmitted to the PCB fab house so be warned. Spark Fun Electronics SKU : PRT-00119 SMT: CONN-08106 Mating wall wart : TOL-00298 (and others)
J2 = 1SparkFun-Connectors:CONN_05X2: Multi connection point. Often used as Generic Header-pin footprint for 0.1 inch spaced/style header connections For AVR SPI programming port, see special device with nice symbol: "AVR_SPI_PROG_5x2.dev" You can populate with any combo of single row headers, but if you'd like an exact match, check these: 2x5 AVR ICSP Male Header <https://www.sparkfun.com/products/778> (PRT-00778) 2x5 Pin Shrouded Header <https://www.sparkfun.com/products/8506> (PRT-08506) On any of the 0.1 inch spaced packages, you can populate with these: Break Away Headers - Straight <https://www.sparkfun.com/products/116> (PRT-00116) Break Away Male Headers - Right Angle <https://www.sparkfun.com/products/553> (PRT-00553) Female Headers <https://www.sparkfun.com/products/115> (PRT-00115) Break Away Headers - Machine Pin <https://www.sparkfun.com/products/117> (PRT-00117) Break Away Female Headers - Swiss Machine Pin <https://www.sparkfun.com/products/743> (PRT-00743) Special note: the shrouded connector mates well with our 5x2 ribbon cables: 2x5 Pin IDC Ribbon Cable <https://www.sparkfun.com/products/8535> (PRT-08535); PROD_ID: CONN-08499; SF_ID: PRT-0778
J3 = 1SparkFun-Connectors:CONN_20X2_ZHU: Multi connection point. Often used as Generic Header-pin footprint for 0.1 inch spaced/style header connections On any of the 0.1 inch spaced packages, you can populate with these: Break Away Headers - Straight <https://www.sparkfun.com/products/116> (PRT-00116) Break Away Male Headers - Right Angle <https://www.sparkfun.com/products/553> (PRT-00553) Female Headers <https://www.sparkfun.com/products/115> (PRT-00115) Break Away Headers - Machine Pin <https://www.sparkfun.com/products/117> (PRT-00117) Break Away Female Headers - Swiss Machine Pin <https://www.sparkfun.com/products/743> (PRT-00743)
J4 = SparkFun-Connectors:M04: Header 4 Standard 4-pin 0.1" header. Use with straight break away headers (SKU : PRT-00116), right angle break away headers (PRT-00553), swiss pins (PRT-00743), machine pins (PRT-00117), and female headers (PRT-00115). Molex polarized connector foot print use with SKU : PRT-08231 with associated crimp pins and housings. 1MM SMD Version SKU: PRT-10208; PARTNO: OSTTE040104
J5 J6 = SparkFun-Connectors:CONN_03_2.54MM: Multi connection point. Often used as Generic Header-pin footprint for 0.1 inch spaced/style header connections On any of the 0.1 inch spaced packages, you can populate with these: Break Away Headers - Straight <https://www.sparkfun.com/products/116> (PRT-00116) Break Away Male Headers - Right Angle <https://www.sparkfun.com/products/553> (PRT-00553) Female Headers <https://www.sparkfun.com/products/115> (PRT-00115) Break Away Headers - Machine Pin <https://www.sparkfun.com/products/117> (PRT-00117) Break Away Female Headers - Swiss Machine Pin <https://www.sparkfun.com/products/743> (PRT-00743) Stackable Header - 3 Pin (Female, 0.1") <https://www.sparkfun.com/products/13875> (PRT-13875) For SCREWTERMINALS and SPRING TERMINALS visit here: Screw Terimnals on SparkFun.com <https://www.sparkfun.com/search/results?term=Screw+Terminals> (5mm/3.5mm/2.54mm spacing) This device is also useful as a general connection point to wire up your design to another part of your project. Our various solder wires solder well into these plated through hole pads. Hook-Up Wire - Assortment (Stranded, 22 AWG) <https://www.sparkfun.com/products/11375> (PRT-11375) Hook-Up Wire - Assortment (Solid Core, 22 AWG) <https://www.sparkfun.com/products/11367> (PRT-11367) View the entire wire category on our website here <https://www.sparkfun.com/categories/141> Special notes: Molex polarized connector foot print use with SKU : PRT-08232 with associated crimp pins and housings.
J7 = 1SparkFun-Connectors:CONN_15X2_ZHU: Multi connection point. Often used as Generic Header-pin footprint for 0.1 inch spaced/style header connections On any of the 0.1 inch spaced packages, you can populate with these: Break Away Headers - Straight <https://www.sparkfun.com/products/116> (PRT-00116) Break Away Male Headers - Right Angle <https://www.sparkfun.com/products/553> (PRT-00553) Female Headers <https://www.sparkfun.com/products/115> (PRT-00115) Break Away Headers - Machine Pin <https://www.sparkfun.com/products/117> (PRT-00117) Break Away Female Headers - Swiss Machine Pin <https://www.sparkfun.com/products/743> (PRT-00743)
J8 J9 J13-J15 = 1SparkFun-Connectors:CONN_02: Multi connection point. Often used as Generic Header-pin footprint for 0.1 inch spaced/style header connections On any of the 0.1 inch spaced packages, you can populate with these: Break Away Headers - Straight <https://www.sparkfun.com/products/116> (PRT-00116) Break Away Male Headers - Right Angle <https://www.sparkfun.com/products/553> (PRT-00553) Female Headers <https://www.sparkfun.com/products/115> (PRT-00115) Break Away Headers - Machine Pin <https://www.sparkfun.com/products/117> (PRT-00117) Break Away Female Headers - Swiss Machine Pin <https://www.sparkfun.com/products/743> (PRT-00743) For SCREWTERMINALS and SPRING TERMINALS visit here: Screw Terimnals on SparkFun.com <https://www.sparkfun.com/search/results?term=Screw+Terminals> (5mm/3.5mm/2.54mm spacing) This device is also useful as a general connection point to wire up your design to another part of your project. Our various solder wires solder well into these plated through hole pads. Hook-Up Wire - Assortment (Stranded, 22 AWG) <https://www.sparkfun.com/products/11375> (PRT-11375) Hook-Up Wire - Assortment (Solid Core, 22 AWG) <https://www.sparkfun.com/products/11367> (PRT-11367) View the entire wire category on our website here <https://www.sparkfun.com/categories/141> Special notes: Molex polarized connector foot print use with: PRT-08233 with associated crimp pins and housings. 2.54_SCREWTERM for use with PRT-10571. 3.5mm Screw Terminal footprints for PRT-08084 5mm Screw Terminal footprints for use with PRT-08432
J10 J11 = Seeed-Connector:GROVE-CONNECTOR-DIP-90D(4P-2.0): 320110034
J12 = SparkFun-Connectors:CONN_02: Multi connection point. Often used as Generic Header-pin footprint for 0.1 inch spaced/style header connections On any of the 0.1 inch spaced packages, you can populate with these: Break Away Headers - Straight <https://www.sparkfun.com/products/116> (PRT-00116) Break Away Male Headers - Right Angle <https://www.sparkfun.com/products/553> (PRT-00553) Female Headers <https://www.sparkfun.com/products/115> (PRT-00115) Break Away Headers - Machine Pin <https://www.sparkfun.com/products/117> (PRT-00117) Break Away Female Headers - Swiss Machine Pin <https://www.sparkfun.com/products/743> (PRT-00743) For SCREWTERMINALS and SPRING TERMINALS visit here: Screw Terimnals on SparkFun.com <https://www.sparkfun.com/search/results?term=Screw+Terminals> (5mm/3.5mm/2.54mm spacing) This device is also useful as a general connection point to wire up your design to another part of your project. Our various solder wires solder well into these plated through hole pads. Hook-Up Wire - Assortment (Stranded, 22 AWG) <https://www.sparkfun.com/products/11375> (PRT-11375) Hook-Up Wire - Assortment (Solid Core, 22 AWG) <https://www.sparkfun.com/products/11367> (PRT-11367) View the entire wire category on our website here <https://www.sparkfun.com/categories/141> Special notes: Molex polarized connector foot print use with: PRT-08233 with associated crimp pins and housings. 2.54_SCREWTERM for use with PRT-10571. 3.5mm Screw Terminal footprints for PRT-08084 5mm Screw Terminal footprints for use with PRT-08432; PROD_ID: CONN-11443
L10 L11_NC L12_NC L13_NC = RedBear:L
LED1 LED2 = SparkFun:LED: LEDs Standard schematic elements and footprints for 5mm, 3mm, 1206, and 0603 sized LEDs. 5mm - Spark Fun Electronics SKU : COM-00529 (and others)
NFC1 = Particle:IPEX-20279-001E: Ultra Miniature Coaxial SMT RF Receptacle
Q1 Q2 = RedBear:PMOS: PMOS
Q3 Q4 = bondmobility-v004:PMOS_IRF7424
R1 R10 = rcl:R-US_: RESISTOR, American symbol; SPICEPREFIX: R
R2-R5 R7 R9 R21 R23-R25 R28 = particle SZ:RES: RES
R11 R31 R35 R40 R47 R49 = Particle:R-US_: 0402 Resistor
R12 R13 R41 R44 R87 = rcl:R-US_: RESISTOR, American symbol
R14 R32 R34 R43 = Asset Tracker SoM v0.01:REDBEAR_RES: RES
R15-R19 R22 R26 R27 R29 R39 R42 = RedBear:RES: RES
R20 R33 R37 = Particle Testing fleet board_Gen3:RESISTOR: Resistor Basic schematic elements and footprints for 0603, 1206, and PTH 1/10th watt (small) resistors.
R30 R36 = SparkFun:RESISTOR: Resistor Basic schematic elements and footprints for 0603, 1206, and PTH 1/10th watt (small) resistors.
R38 = SparkFun-Resistors:100OHM-1/10W-1%(0603): RES-07863; PROD_ID: RES-07863; VALUE: 100
RGB = Particle:RGB-LED-CLMVB-FKA: CREE CLMVB-FKA RGB LED 2mm x 2mm
S2 S3 = SparkFun-Switches:MOMENTARY-SWITCH-SPST: Momentary Switch (Pushbutton) - SPST Normally-open (NO) SPST momentary switches (buttons, pushbuttons). Variants PTH-12MM - 12mm square, through-hole Momentary Pushbutton Switch - 12mm Square <https://www.sparkfun.com/products/9190> (COM-09190) PTH-6.0MM, PTH-6.0MM-KIT - 6.0mm square, through-hole Mini Pushbutton Switch <https://www.sparkfun.com/products/97> (COM-00097) KIT package intended for soldering kit's - only one side of pads' copper is exposed. PTH-RIGHT-ANGLE-KIT - Right-angle, through-hole Right Angle Tactile Button <https://www.sparkfun.com/products/10791> - Used on SparkFun BigTime Watch Kit <https://www.sparkfun.com/products/11734> SMD-12MM - 12mm square, surface-mount Tactile Button - SMD (12mm) <https://www.sparkfun.com/products/12993> (COM-12993) Used on SparkFun PicoBoard <https://www.sparkfun.com/products/11888> SMD-4.5MM - 4.5mm Square Trackball Switch Used on SparkFun Blackberry Trackballer Breakout <https://www.sparkfun.com/products/13169> SMD-4.6MMX2.8MM - 4.60mm x 2.80mm, surface mount Used on SparkFun SAMD21 Mini Breakout <https://www.sparkfun.com/products/13664> SMD-5.2MM, SMD-5.2-REDUNDANT - 5.2mm square, surface-mount Mini Pushbutton Switch - SMD <https://www.sparkfun.com/products/8720> (COM-08720) Used on Arduino Pro Mini <https://www.sparkfun.com/products/11114> REDUNDANT package connects both switch circuits together SMD-6.0X3.5MM - 6.0 x 3.5mm, surface mount Momentary Reset Switch SMD <https://www.sparkfun.com/products/8229> (COM-08229) SMD-6.2MM-TALL - 6.2mm square, surface mount Tactile Button - SMD (6mm) <https://www.sparkfun.com/products/12992> Used on SparkFun Digital Sandbox <https://www.sparkfun.com/products/12651> SMD-RIGHT-ANGLE - Right-angle, surface mount Used on SparkFun Block for Intel® Edison - Arduino <https://www.sparkfun.com/products/13036>; PROD_ID: SWCH-08441; SF_SKU: COM-00097
S4-S6 = SparkFun-Retired:SWITCH-DPDT: DPDT Version of the COM-00597
TP1-TP4 TP6-TP29 TP31-TP33 TP37 TP46 TP51-TP55 TP59-TP71 TP73-TP75 = testpad:TPS: TEST PIN
U1 = rickk2:TRACKER-SOM-3A: Asset Tracker SoM
U2 U4 U8 = Particle:SN74LV1T34: Texas Instruments Single Power Supply Single Buffer GATE CMOS Logic Level Shifter
U3 = Particle:CR2032_HOLDER
U5 = AT SoM EVAL board v0.3:LP5910: 3.5V to 28V Input, 5A, 570kHz Step-Down Converter with Eco-mode Source: Datasheet <http://www.ti.com/lit/gpn/tps54531>
U6 = AT SoM EVAL board v0.3:TLV70433DBVR: 3.5V to 28V Input, 5A, 570kHz Step-Down Converter with Eco-mode Source: Datasheet <http://www.ti.com/lit/gpn/tps54531>
U$4 = Particle:TP: Test Points of all sizes and shapes
U$9 U$10 = Spark:TP: Test Points of all sizes and shapes
USB1 USB3 = RedBear:MICRO_USB: Micro-USB
USB2 = SparkFun-Connectors:USB_C: USB Type C 16Pin Connector Super Speed pins not available on the 16-pin purely SMD connector so this part is best for USB 2.0 implementations. D1 and D2 are tied together enabling D+/- no matter which way the cable is plugged into the connector. The two channel configuration pins (CC1/2) are exposed. These are normally connected to ground via 5.1k resistors but can be reconfigured for high current/high power applications.; PROD_ID: CONN-14122
X1-X3 = con-coax:BU-SMA-G: FEMALE SMA CONNECTOR Radiall distributor RS 193-9117; OC_FARNELL: unknown; OC_NEWARK: unknown

## Net classes
0 default: width 0.152 mm, clearance 0.152 mm
2 RF: width 0.203 mm, clearance 0.257 mm
3 usb_lay3: width 0.152 mm, clearance 0.191 mm
4 3V3: width 0.305 mm, clearance 0.508 mm
5 USB_top: width 0.254 mm, drill 0.2 mm, clearance 0.178 mm
6 +3V3: width 0.203 mm, clearance 0.152 mm
7 PMID: width 0.305 mm, clearance 0.508 mm
8 CAN: width 0.152 mm, clearance 0.267 mm